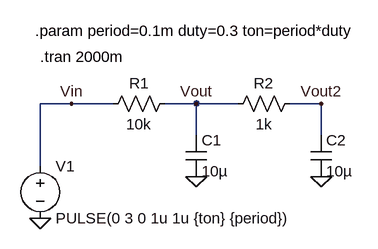
[diagram p0: schematic PWM_filter.asc]
PWM_filter.asc, the LTspice schematic file:
Version 4
SHEET 1 880 680
WIRE 128 0 80 0
WIRE 192 0 128 0
WIRE 320 0 272 0
WIRE 384 0 320 0
WIRE 512 0 464 0
WIRE 320 48 320 0
WIRE 512 48 512 0
WIRE 80 96 80 0
FLAG 80 176 0
FLAG 320 112 0
FLAG 128 0 Vin
FLAG 320 0 Vout
FLAG 512 112 0
FLAG 512 0 Vout2
SYMBOL voltage 80 80 R0
WINDOW 123 0 0 Left 0
WINDOW 39 0 0 Left 0
SYMATTR InstName V1
SYMATTR Value PULSE(0 3 0 1u 1u {ton} {period})
SYMBOL res 288 -16 R90
WINDOW 0 0 56 VBottom 2
WINDOW 3 32 56 VTop 2
SYMATTR InstName R1
SYMATTR Value 10k
SYMBOL cap 304 48 R0
SYMATTR InstName C1
SYMATTR Value 10µ
SYMBOL res 480 -16 R90
WINDOW 0 0 56 VBottom 2
WINDOW 3 32 56 VTop 2
SYMATTR InstName R2
SYMATTR Value 1k
SYMBOL cap 496 48 R0
SYMATTR InstName C2
SYMATTR Value 10µ
TEXT 80 -72 Left 2 !.tran 2000m
TEXT 72 -112 Left 2 !.param period=0.1m duty=0.3 ton=period*duty

The netlist it stands for:
* PWM_filter.asc
V1 Vin 0 PULSE(0 3 0 1u 1u {ton} {period})
R1 Vout Vin 10k
C1 Vout 0 10µ
R2 Vout2 Vout 1k
C2 Vout2 0 10µ
.tran 2000m
.param period=0.1m duty=0.3 ton=period*duty
.backanno
.end